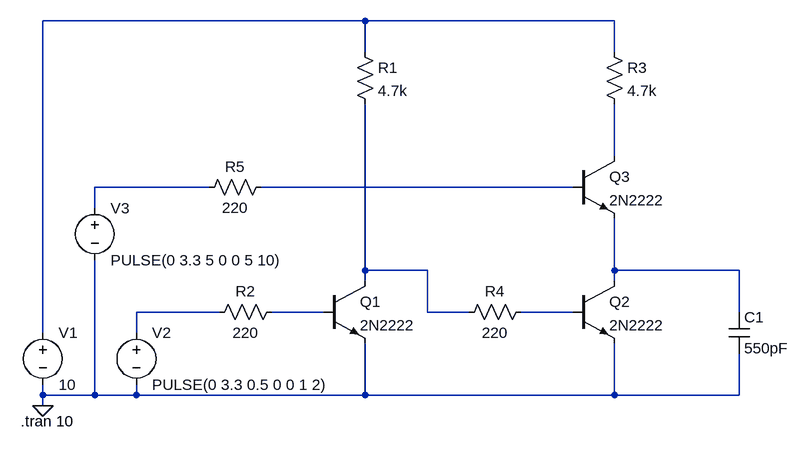
[diagram p0: schematic driver_prototype.asc]
driver_prototype.asc, the LTspice schematic file:
Version 4
SHEET 1 1140 680
WIRE 480 -384 -16 -384
WIRE 864 -384 480 -384
WIRE 480 -336 480 -384
WIRE 864 -336 864 -384
WIRE 864 -176 864 -256
WIRE 240 -128 64 -128
WIRE 800 -128 320 -128
WIRE 64 -96 64 -128
WIRE 480 0 480 -256
WIRE 576 0 480 0
WIRE 864 0 864 -80
WIRE 1056 0 864 0
WIRE 480 16 480 0
WIRE 864 16 864 0
WIRE 256 64 128 64
WIRE 416 64 336 64
WIRE 576 64 576 0
WIRE 640 64 576 64
WIRE 800 64 720 64
WIRE 1056 64 1056 0
WIRE -16 96 -16 -384
WIRE 128 96 128 64
WIRE -16 192 -16 176
WIRE 64 192 64 -16
WIRE 64 192 -16 192
WIRE 128 192 128 176
WIRE 128 192 64 192
WIRE 480 192 480 112
WIRE 480 192 128 192
WIRE 864 192 864 112
WIRE 864 192 480 192
WIRE 1056 192 1056 128
WIRE 1056 192 864 192
WIRE -16 208 -16 192
FLAG -16 208 0
SYMBOL voltage -16 80 R0
WINDOW 123 0 0 Left 0
WINDOW 39 0 0 Left 0
SYMATTR InstName V1
SYMATTR Value 10
SYMBOL npn 416 16 R0
SYMATTR InstName Q1
SYMATTR Value 2N2222
SYMBOL res 464 -352 R0
SYMATTR InstName R1
SYMATTR Value 4.7k
SYMBOL res 352 48 R90
WINDOW 0 0 56 VBottom 2
WINDOW 3 32 56 VTop 2
SYMATTR InstName R2
SYMATTR Value 220
SYMBOL voltage 128 80 R0
WINDOW 123 0 0 Left 0
WINDOW 39 0 0 Left 0
SYMATTR InstName V2
SYMATTR Value PULSE(0 3.3 0.5 0 0 1 2)
SYMBOL npn 800 16 R0
SYMATTR InstName Q2
SYMATTR Value 2N2222
SYMBOL res 848 -352 R0
SYMATTR InstName R3
SYMATTR Value 4.7k
SYMBOL res 736 48 R90
WINDOW 0 0 56 VBottom 2
WINDOW 3 32 56 VTop 2
SYMATTR InstName R4
SYMATTR Value 220
SYMBOL cap 1040 64 R0
SYMATTR InstName C1
SYMATTR Value 550pF
SYMBOL npn 800 -176 R0
SYMATTR InstName Q3
SYMATTR Value 2N2222
SYMBOL voltage 64 -112 R0
WINDOW 123 0 0 Left 0
WINDOW 39 0 0 Left 0
SYMATTR InstName V3
SYMATTR Value PULSE(0 3.3 5 0 0 5 10)
SYMBOL res 336 -144 R90
WINDOW 0 0 56 VBottom 2
WINDOW 3 32 56 VTop 2
SYMATTR InstName R5
SYMATTR Value 220
TEXT -50 232 Left 2 !.tran 10

The netlist it stands for:
* driver_prototype.asc
V1 N001 0 10
Q1 N005 N008 0 0 2N2222
R1 N001 N005 4.7k
R2 N008 N007 220
V2 N007 0 PULSE(0 3.3 0.5 0 0 1 2)
Q2 N006 N009 0 0 2N2222
R3 N001 N002 4.7k
R4 N009 N005 220
C1 N006 0 550pF
Q3 N002 N004 N006 0 2N2222
V3 N003 0 PULSE(0 3.3 5 0 0 5 10)
R5 N004 N003 220
.model NPN NPN
.model PNP PNP
.lib standard.bjt
.tran 10
.backanno
.end